# EAGLE schematic board (EAGLE 4.16)
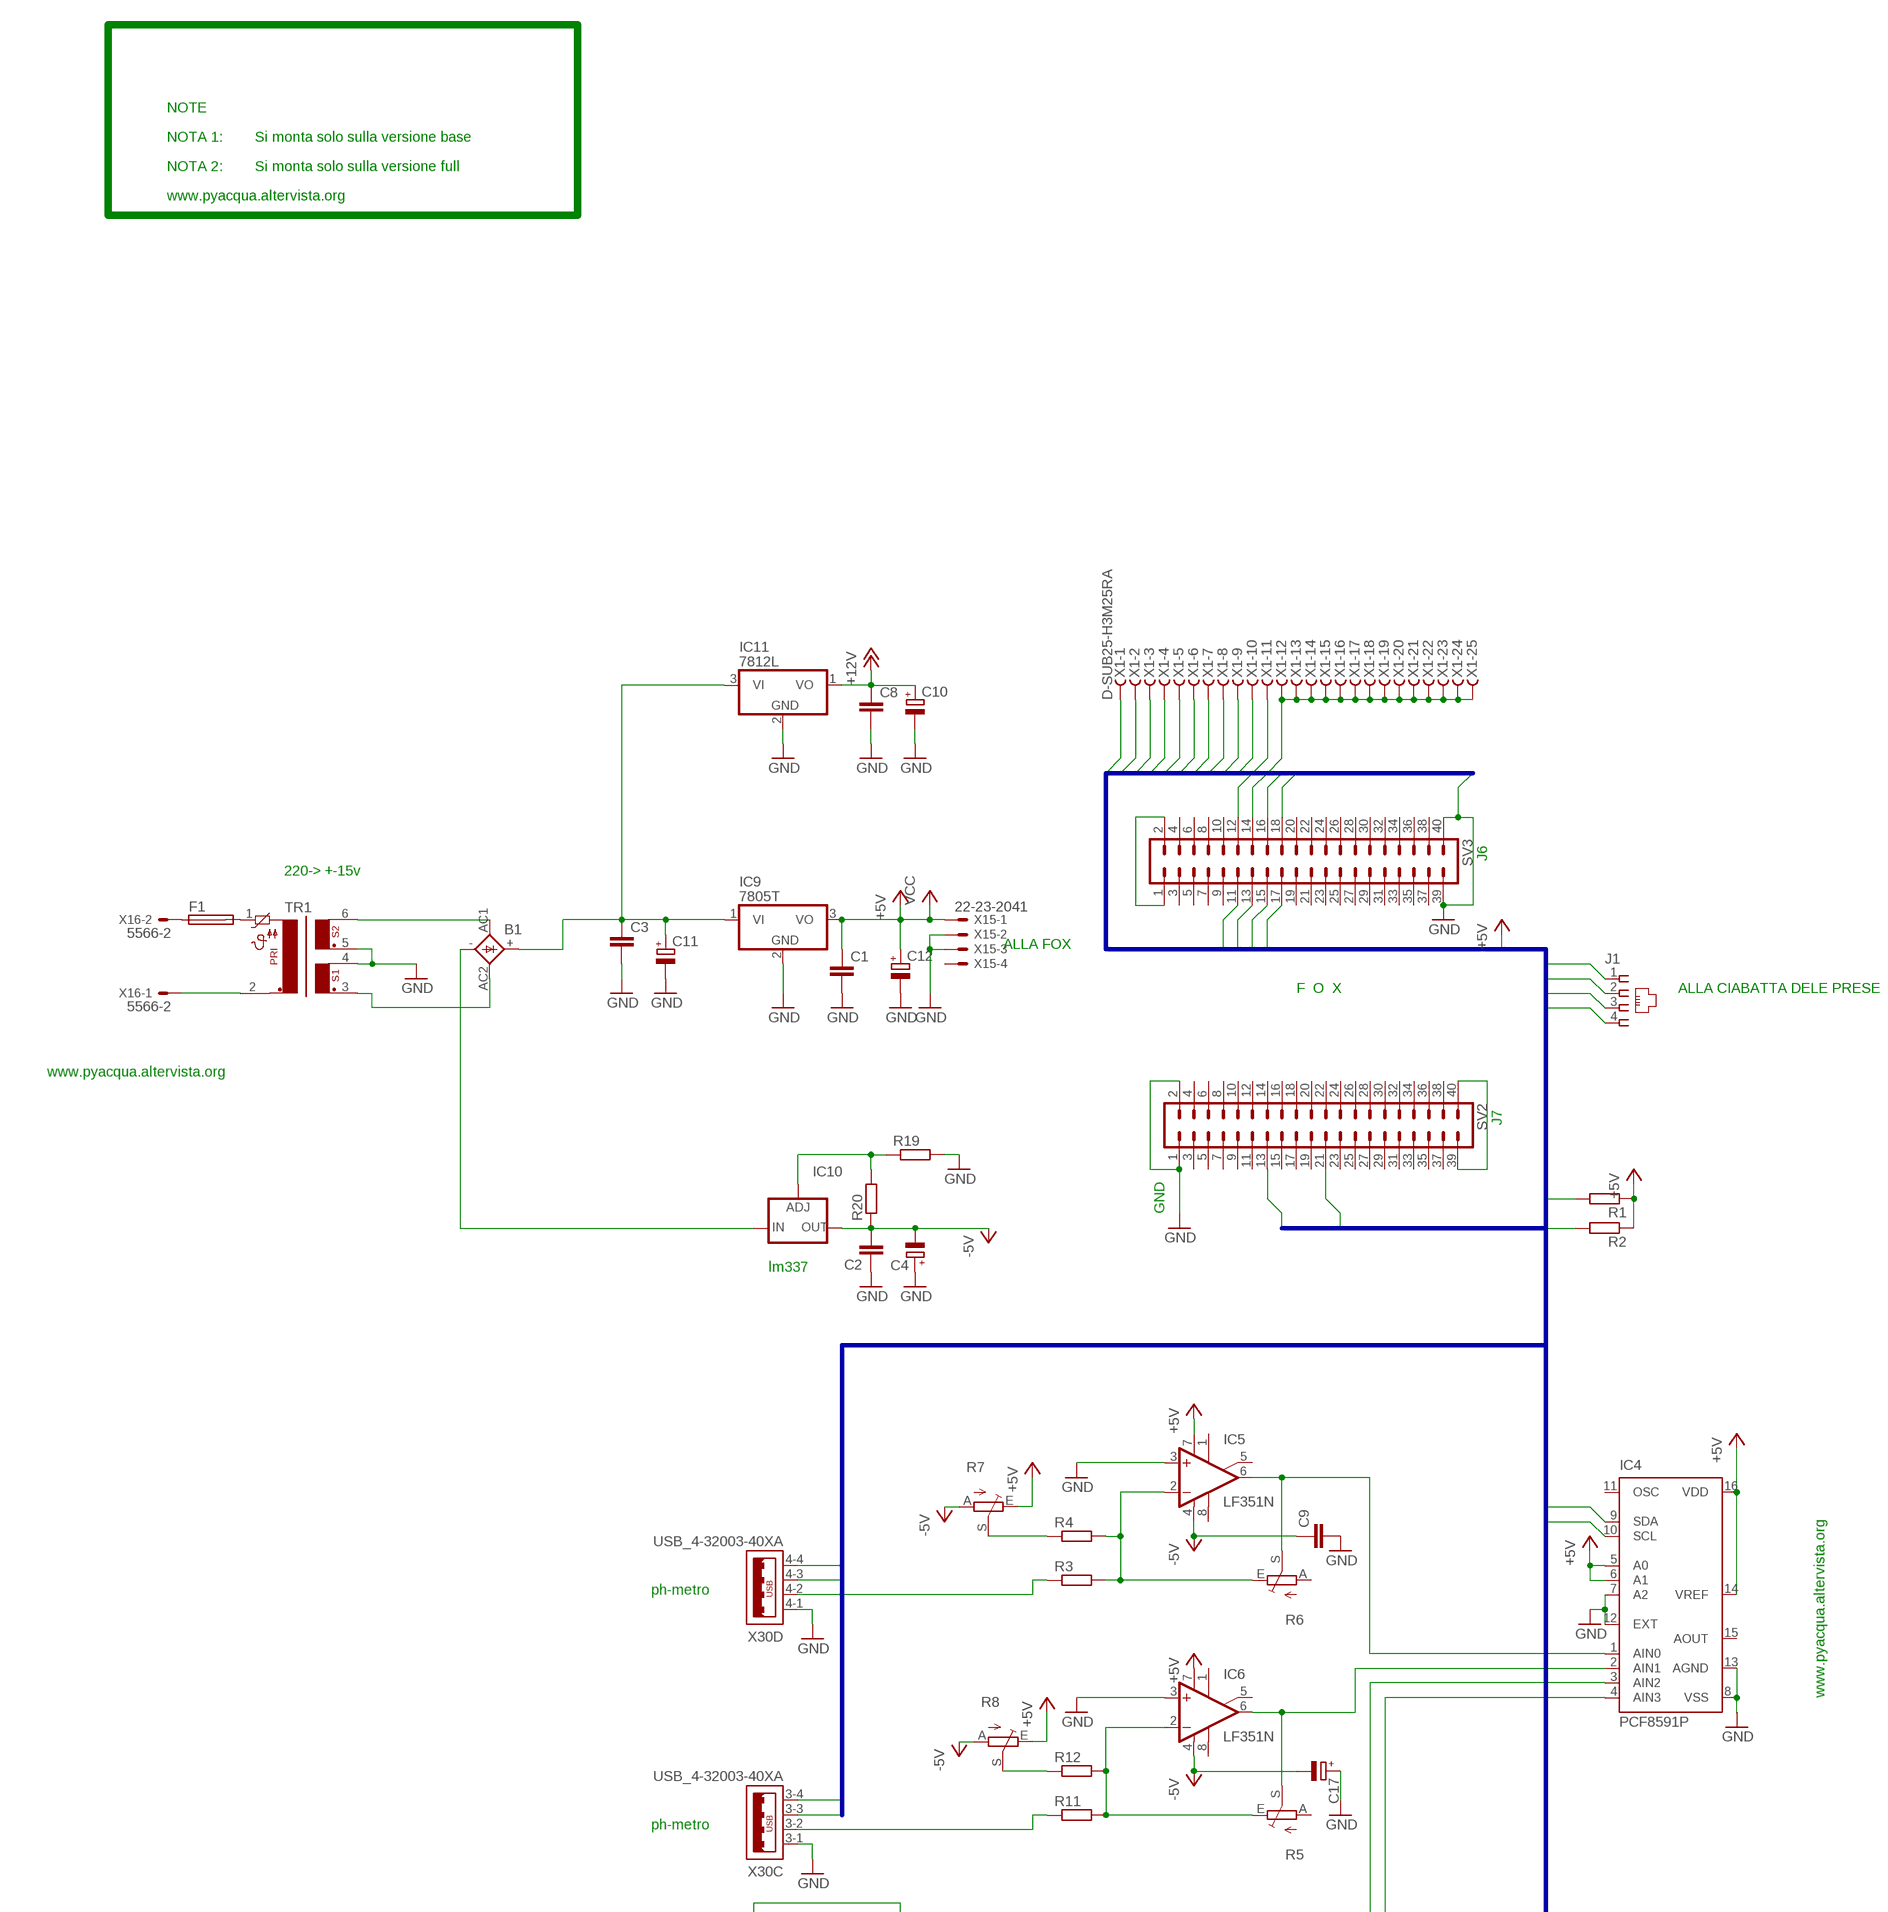
[diagram p0: schematic, sheet 1, part 1 of 3]
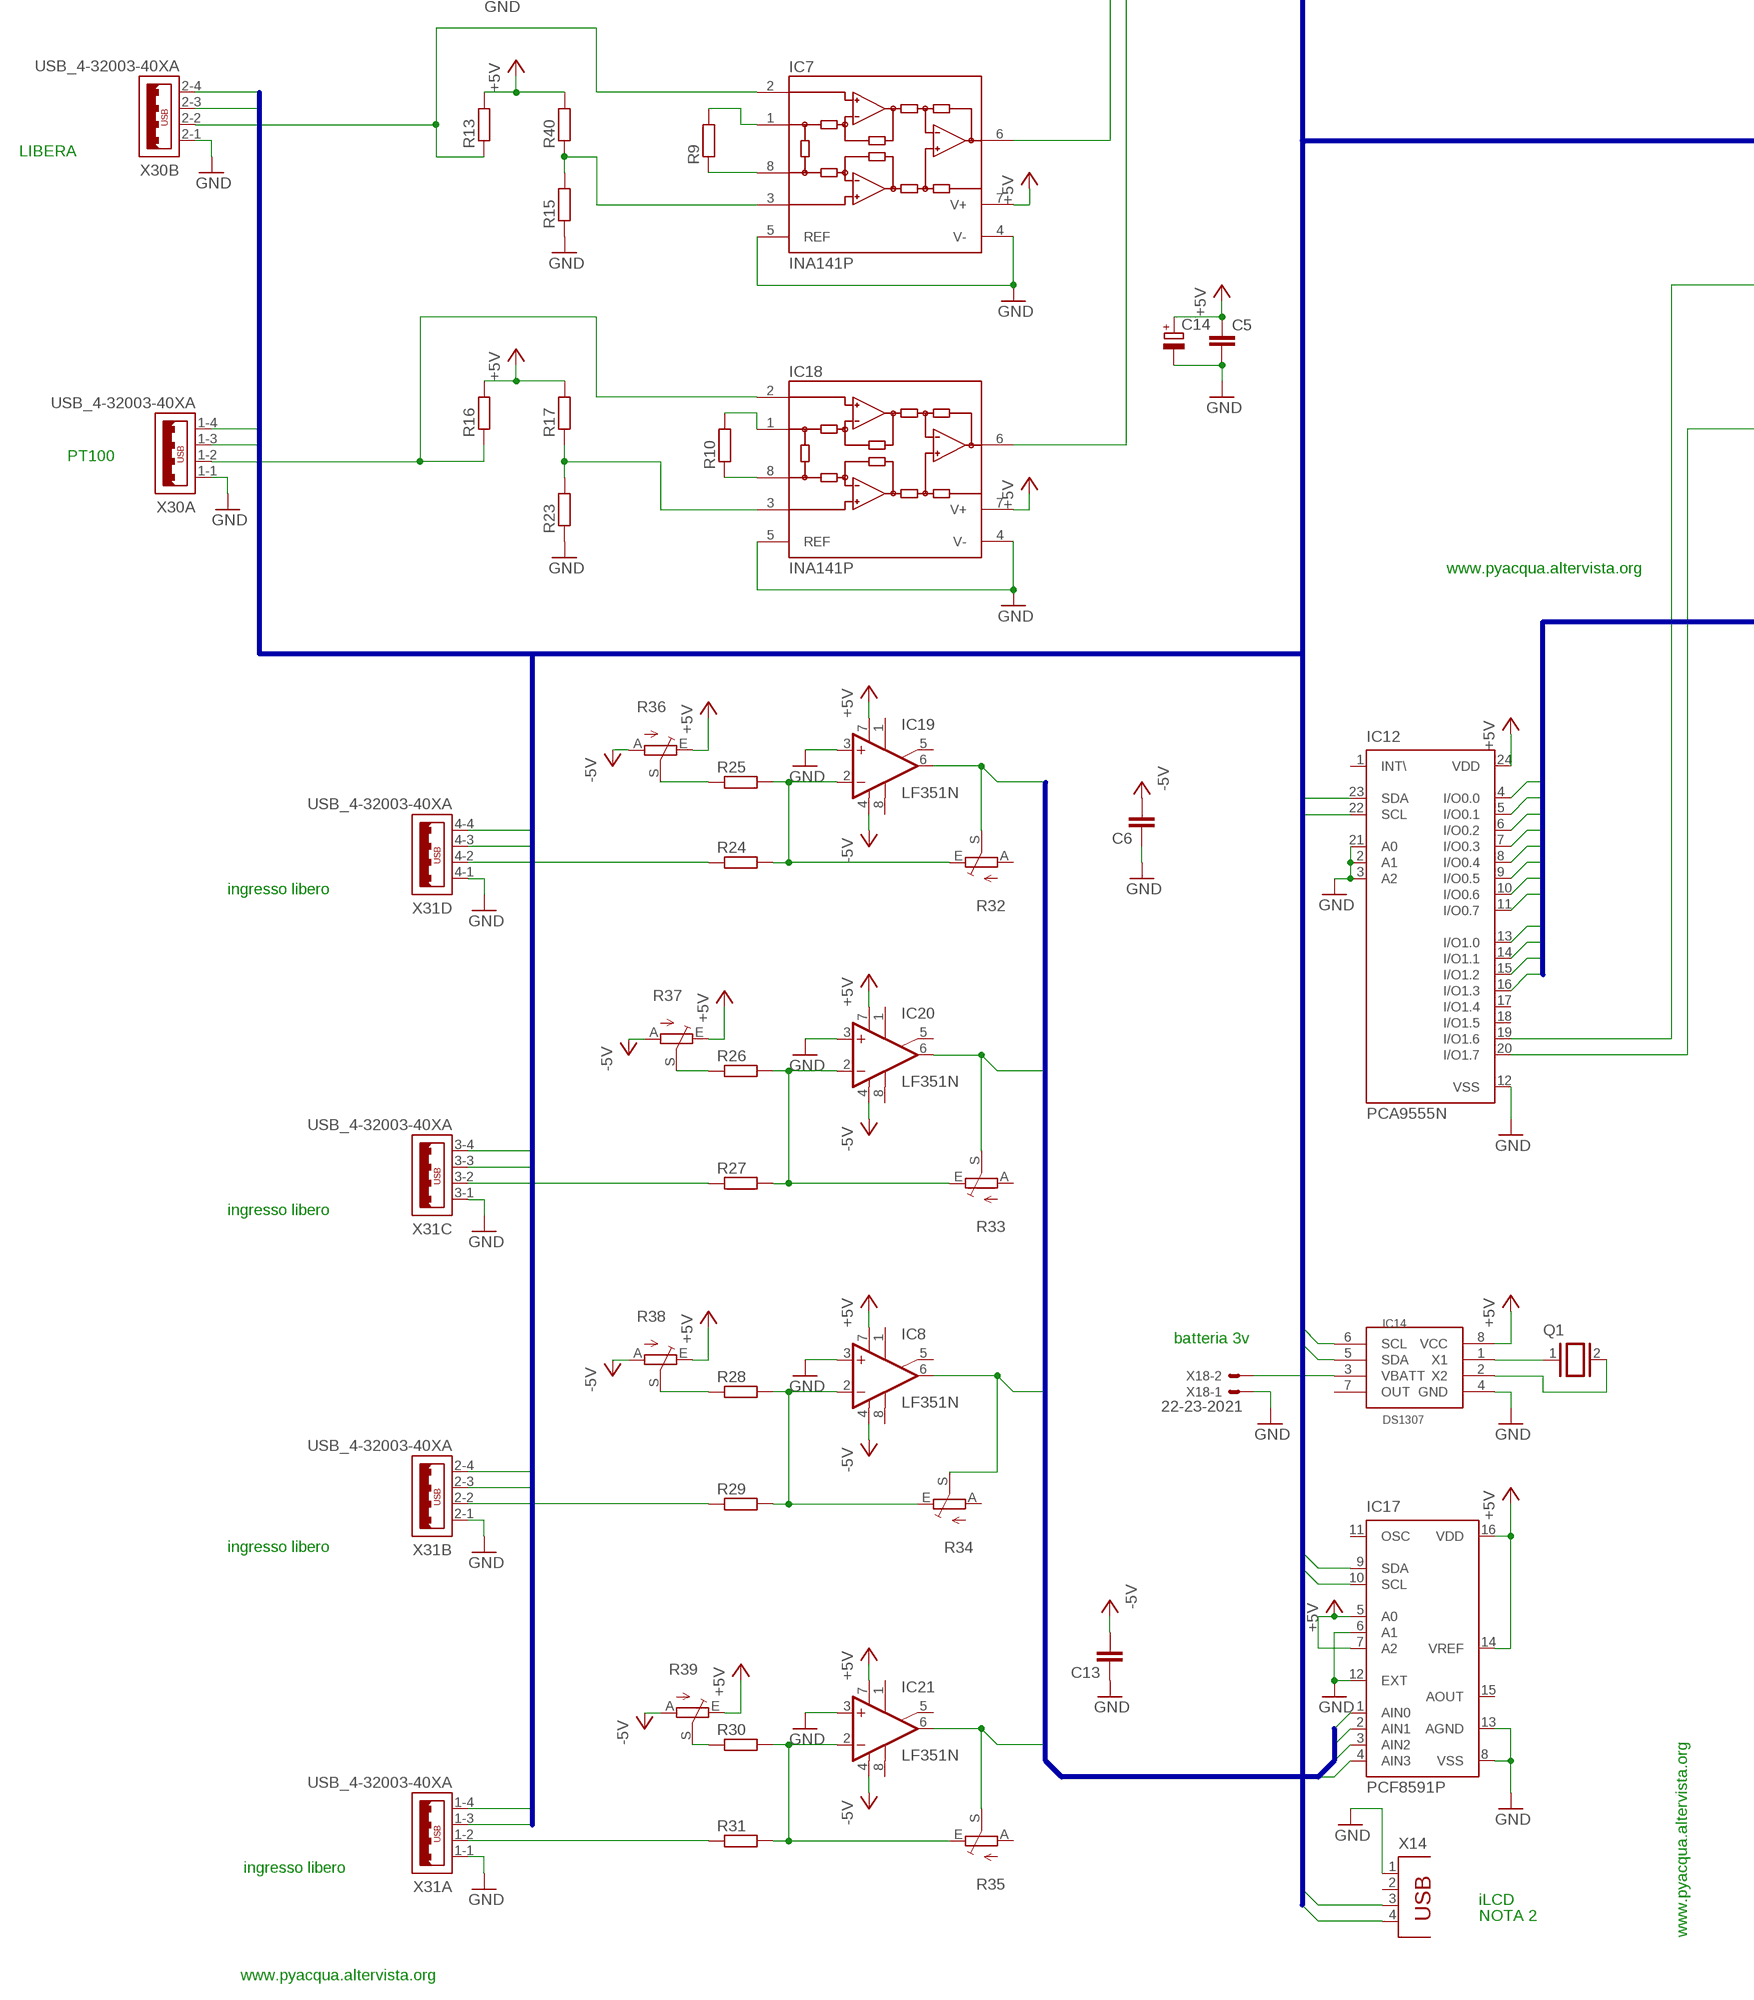
[diagram p1: schematic, sheet 1, part 2 of 3]
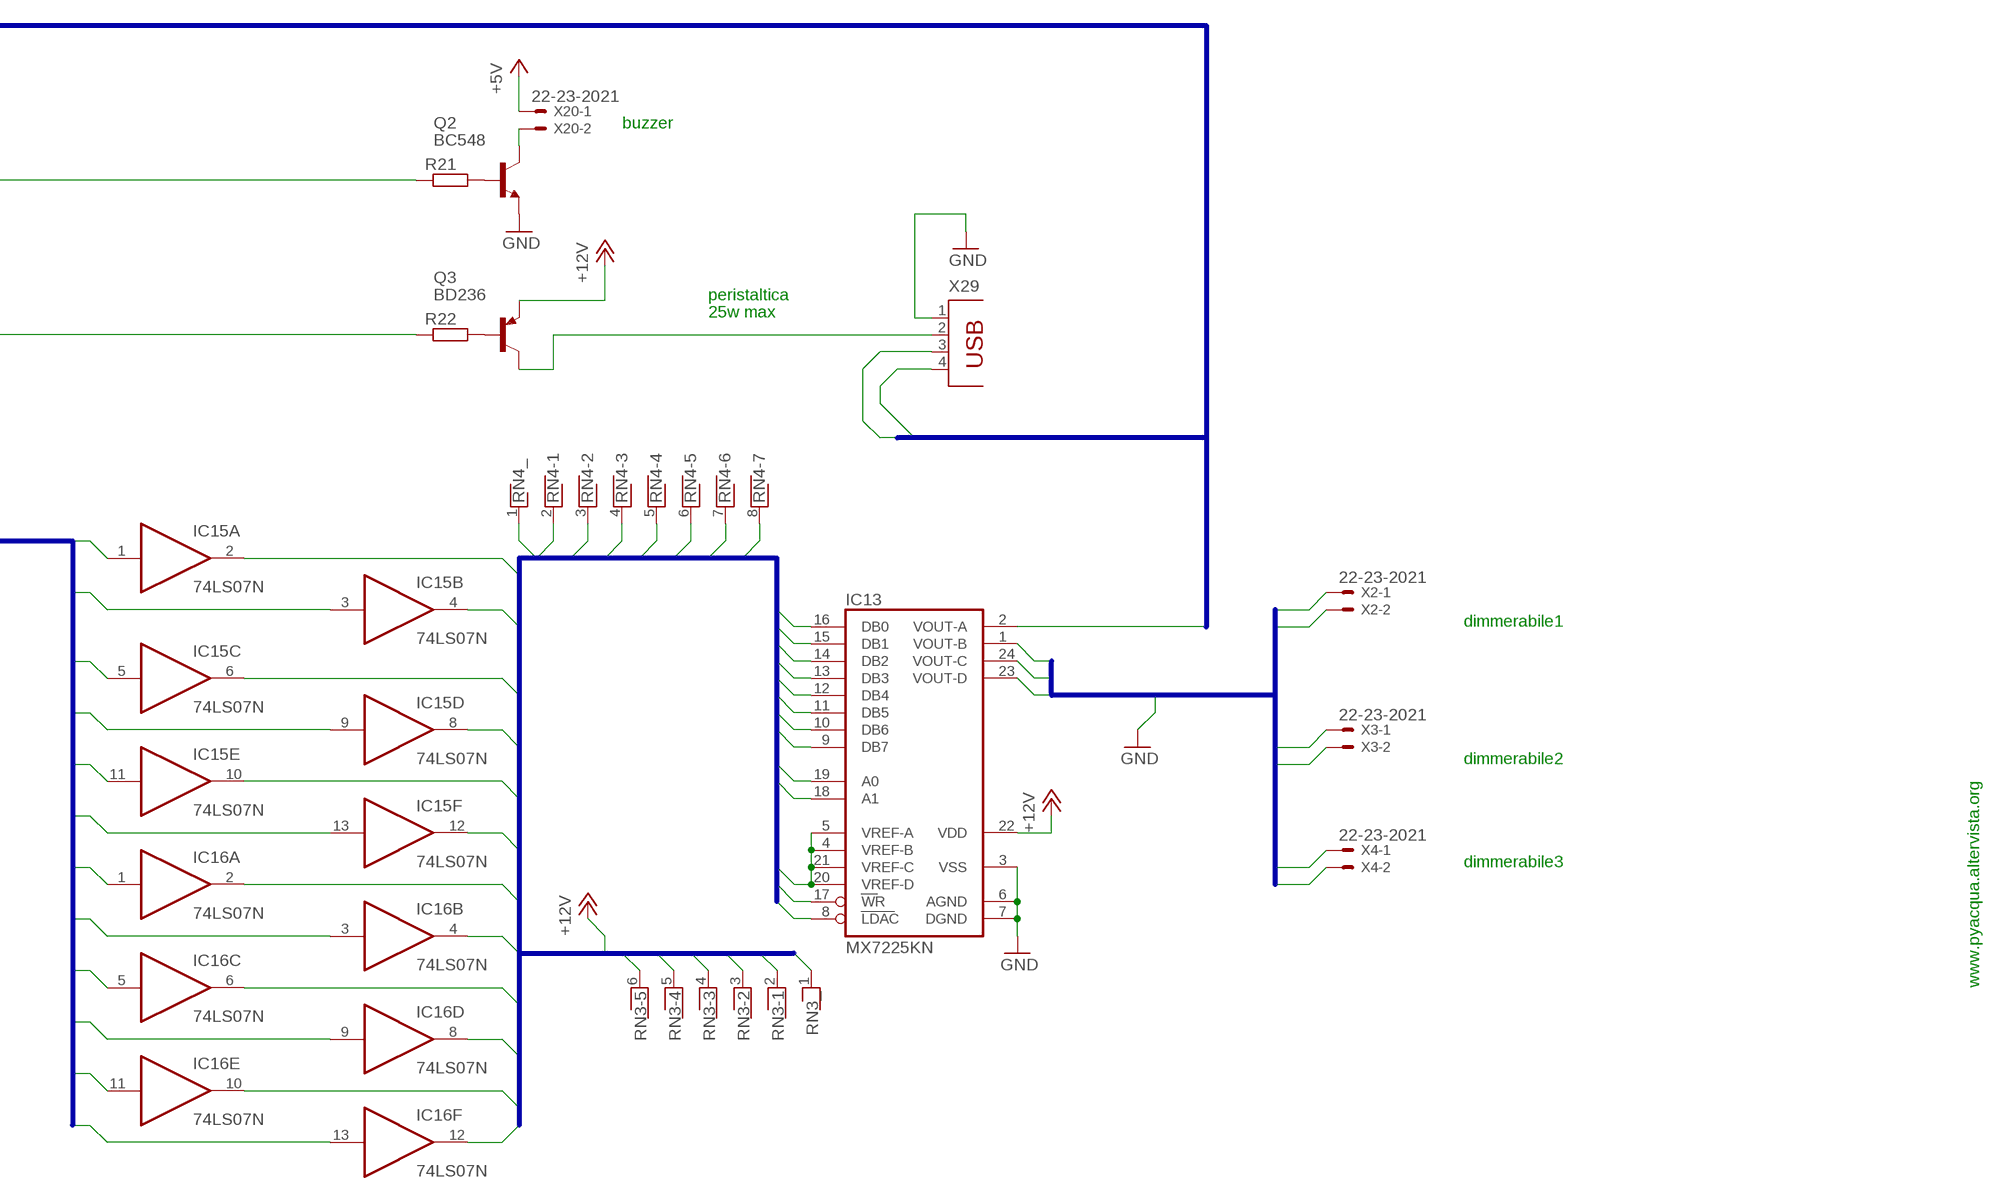
[diagram p2: schematic, sheet 1, part 3 of 3]

## Parts
B1  2KBP  [2KBP]
C1  C-EU025-040X050  [C025-040X050]
C2  C-EU025-040X050  [C025-040X050]
C3  C-EU025-040X050  [C025-040X050]
C4  CPOL-EUE2-5  [E2-5]
C5  C-EU025-040X050  [C025-040X050]
C6  C-EU025-060X050  [C025-060X050]
C8  C-EU025-050X050  [C025-050X050]
C9  C-EU025-040X050  [C025-040X050]
C10  CPOL-EUE2-5  [E2-5]
C11  CPOL-EUE2.5-6  [E2,5-6]
C12  CPOL-EUE2.5-6  [E2,5-6]
C13  C-EU025-060X050  [C025-060X050]
C14  CPOL-EUE2.5-6  [E2,5-6]
C17  CPOL-EUE2.5-6  [E2,5-6]
F1  GSH15  [GSH15]
IC4  PCF8591P  [DIL16]
IC5  LF351N  [DIL08]
IC6  LF351N  [DIL08]
IC7  INA141P  [DIL08]
IC8  LF351N  [DIL08]
IC9  7805T  [TO220H]
IC10  LM337L  [337L]
IC11  7812L  [TO92]
IC12  PCA9555N  [DIL24-6]
IC13  MX7225KN  [DIL24-6]
IC14  DS1307  [DS1307]
IC15  74LS07N  [DIL14]
IC16  74LS07N  [DIL14]
IC17  PCF8591P  [DIL16]
IC18  INA141P  [DIL08]
IC19  LF351N  [DIL08]
IC20  LF351N  [DIL08]
IC21  LF351N  [DIL08]
J1  520242-2  [520242-2]
Q1  XTAL  [Q]
Q2  BC548  [TO92-EBC]
Q3  BD236  [TO126]
R1  R-EU_0207/10  [0207/10]
R2  R-EU_0207/10  [0207/10]
R3  R-EU_0207/10  [0207/10]
R4  R-EU_0207/10  [0207/10]
R5  TRIM_EU-CT6  [CT6]
R6  TRIM_EU-CT6  [CT6]
R7  TRIM_EU-B25P  [B25P]
R8  TRIM_EU-B25P  [B25P]
R9  R-EU_0207/10  [0207/10]
R10  R-EU_0207/10  [0207/10]
R11  R-EU_0207/10  [0207/10]
R12  R-EU_0207/10  [0207/10]
R13  R-EU_0207/10  [0207/10]
R15  R-EU_0207/10  [0207/10]
R16  R-EU_0207/10  [0207/10]
R17  R-EU_0207/10  [0207/10]
R19  R-EU_0207/10  [0207/10]
R20  R-EU_0207/10  [0207/10]
R21  R-EU_0207/10  [0207/10]
R22  R-EU_0207/10  [0207/10]
R23  R-EU_0207/10  [0207/10]
R24  R-EU_0207/10  [0207/10]
R25  R-EU_0207/10  [0207/10]
R26  R-EU_0207/10  [0207/10]
R27  R-EU_0207/10  [0207/10]
R28  R-EU_0207/10  [0207/10]
R29  R-EU_0207/10  [0207/10]
R30  R-EU_0207/10  [0207/10]
R31  R-EU_0207/10  [0207/10]
R32  TRIM_EU-CT6  [CT6]
R33  TRIM_EU-CT6  [CT6]
R34  TRIM_EU-CT6  [CT6]
R35  TRIM_EU-CT6  [CT6]
R36  TRIM_EU-B25P  [B25P]
R37  TRIM_EU-B25P  [B25P]
R38  TRIM_EU-B25P  [B25P]
R39  TRIM_EU-B25P  [B25P]
R40  R-EU_0207/10  [0207/10]
RN3  RNX5  [RN-6]
RN4  RNX7  [RN-8]
SV2  MA20-2  [MA20-2]
SV3  MA20-2  [MA20-2]
TR1  PT07,5-2  [PT07,5-2]
X1  D-SUB25-H3M25RA  [H3M25RA]
X2  22-23-2021  [22-23-2021]
X3  22-23-2021  [22-23-2021]
X4  22-23-2021  [22-23-2021]
X14  PN87520  [PN87520]
X15  22-23-2041  [22-23-2041]
X16  5566-2  [5566-2]
X18  22-23-2021  [22-23-2021]
X20  22-23-2021  [22-23-2021]
X29  PN87520  [PN87520]
X30  USB_4-32003-40XA  [32003-40XA]
X31  USB_4-32003-40XA  [32003-40XA]

## Nets
12V: IC13.4(VREF-B) IC13.5(VREF-A) IC13.20(VREF-D) IC13.21(VREF-C) RN3.1 RN4.1 ; supply symbol labelled +12V
+5V: C1.1 C5.1 C12.+ C14.+ IC4.5(A0) IC4.6(A1) IC4.14(VREF) IC4.16(VDD) IC5.7(V+) IC6.7(V+) IC7.7(V+) IC8.7(V+) IC9.3(VO) IC12.24(VDD) IC14.8(VCC) IC17.5(A0) IC17.7(A2) IC17.14(VREF) IC17.16(VDD) IC18.7(V+) IC19.7(V+) IC20.7(V+) IC21.7(V+) R1.1 R2.1 R7.E R8.E R13.2 R16.2 R17.2 R36.E R37.E R38.E R39.E R40.2 X15.1 X20.1 ; supply symbol labelled VCC
+12V: C8.1 C10.+ IC11.1(VO) IC13.22(VDD)
-5V: C2.2 C4.- C6.2 C9.1 C13.2 C17.- IC5.4(V-) IC6.4(V-) IC8.4(V-) IC10.OUT IC19.4(V-) IC20.4(V-) IC21.4(V-) R7.A R8.A R20.1 R36.A R37.A R38.A R39.A
A0: IC12.13(I/O1.0) IC13.19(A0) IC16.5(C:I) IC16.6(C:O) RN4.2
A1: IC12.14(I/O1.1) IC13.18(A1) IC16.8(D:O) IC16.9(D:I) RN4.3
CH0: IC17.1(AIN0) IC21.6(OUT) R35.S
CH1: IC8.6(OUT) IC17.2(AIN1) R34.S
CH2: IC17.3(AIN2) IC20.6(OUT) R33.S
CH3: IC17.4(AIN3) IC19.6(OUT) R32.S
CONTRASTO: IC13.2(VOUT-A) X1.5
DATA0: IC13.16(DB0) IC15.2(A:O) RN4.5
DATA1: IC13.15(DB1) IC15.4(B:O) RN4.6
DATA2: IC13.14(DB2) IC15.6(C:O) RN4.7
DATA3: IC13.13(DB3) IC15.8(D:O) RN4.8
DATA4: IC13.12(DB4) IC15.10(E:O) RN3.6 SV3.14 X1.8
DATA5: IC13.11(DB5) IC15.12(F:O) RN3.5 SV3.13 X1.9
DATA6: IC13.10(DB6) IC16.2(A:O) RN3.4 SV3.11 SV3.16 X1.10
DATA7: IC13.9(DB7) IC16.4(B:O) RN3.3 SV3.15 X1.11
DB0: IC12.4(I/O0.0) IC15.1(A:I)
DB1: IC12.5(I/O0.1) IC15.3(B:I)
DB2: IC12.6(I/O0.2) IC15.5(C:I)
DB3: IC12.7(I/O0.3) IC15.9(D:I)
DB4: IC12.8(I/O0.4) IC15.11(E:I)
DB5: IC12.9(I/O0.5) IC15.13(F:I)
DB6: IC12.10(I/O0.6) IC16.1(A:I)
DB7: IC12.11(I/O0.7) IC16.3(B:I)
DIM1: IC13.1(VOUT-B) X2.1
DIM2: IC13.24(VOUT-C) X3.1
DIM3: IC13.23(VOUT-D) X4.1
E: SV3.17 X1.6
GND: C1.2 C2.1 C3.2 C4.+ C5.2 C6.1 C8.2 C9.2 C10.- C11.- C12.- C13.1 C14.- C17.+ IC4.7(A2) IC4.8(VSS) IC4.12(EXT) IC4.13(AGND) IC5.3(+IN) IC6.3(+IN) IC7.4(V-) IC7.5(REF) IC8.3(+IN) IC9.2(GND) IC11.2(GND) IC12.2(A1) IC12.3(A2) IC12.12(VSS) IC12.21(A0) IC13.3(VSS) IC13.6(AGND) IC13.7(DGND) IC14.4(GND) IC17.6(A1) IC17.8(VSS) IC17.12(EXT) IC17.13(AGND) IC18.4(V-) IC18.5(REF) IC19.3(+IN) IC20.3(+IN) IC21.3(+IN) J1.1 Q2.E R15.1 R19.2 R23.1 SV2.1 SV2.2 SV3.39 SV3.40 TR1.4 TR1.5 X1.3 X1.12 X1.13 X1.14 X1.15 X1.16 X1.17 X1.18 X1.19 X1.20 X1.21 X1.22 X1.23 X1.24 X1.25 X2.2 X3.2 X4.2 X14.1 X15.2 X15.3 X18.1 X29.1 X30.1-1 X30.2-1 X30.3-1 X30.4-1 X31.1-1 X31.2-1 X31.3-1 X31.4-1
LDAC: IC12.16(I/O1.3) IC13.8(LDAC) IC16.12(F:O) IC16.13(F:I) RN3.2
N$1: IC12.19(I/O1.6) R21.1
N$2: TR1.2 X16.1
N$3: F1.2 TR1.1
N$4: IC7.8(J) R9.1
N$5: IC7.1(J) R9.2
N$6: IC18.8(J) R10.1
N$7: IC18.1(J) R10.2
N$9: IC4.1(AIN0) IC5.6(OUT) R6.S
N$10: IC4.2(AIN1) IC6.6(OUT) R5.S
N$13: IC4.3(AIN2) IC7.6(OUT)
N$22: IC4.4(AIN3) IC18.6(OUT)
N$26: Q2.B R21.2
N$27: Q2.C X20.2
N$31: R8.S R12.1
N$35: B1.AC1 TR1.6
N$40: Q3.3(B) R22.2
N$42: Q3.1(E)
N$51: IC12.20(I/O1.7) R22.1
N$58: IC5.2(-IN) R3.2 R4.2 R6.E
N$60: R3.1 X30.4-2
N$61: Q3.2(C) X29.2
N$62: R4.1 R7.S
N$63: IC6.2(-IN) R5.E R11.2 R12.2
N$66: IC7.3(+IN) R15.2 R40.1
N$67: B1.- IC10.IN
N$68: IC7.2(-IN) R13.1 X30.2-2
N$69: R11.1 X30.3-2
N$70: SV3.1 SV3.2
N$71: SV2.39 SV2.40
N$74: IC14.3(VBATT) X18.2
N$76: B1.+ C3.1 C11.+ IC9.1(VI) IC11.3(VI)
N$77: IC10.ADJ R19.1 R20.2
N$80: B1.AC2 TR1.3
N$83: IC14.1(X1) Q1.1
N$84: IC14.2(X2) Q1.2
N$85: F1.1 X16.2
N$107: IC18.3(+IN) R17.1 R23.2
N$110: IC18.2(-IN) R16.1 X30.1-2
N$113: IC19.2(-IN) R24.2 R25.2 R32.E
N$114: IC20.2(-IN) R26.2 R27.2 R33.E
N$115: IC8.2(-IN) R28.2 R29.2 R34.E
N$116: IC21.2(-IN) R30.2 R31.2 R35.E
N$117: R31.1 X31.1-2
N$119: R29.1 X31.2-2
N$121: R30.1 R39.S
N$122: R28.1 R38.S
N$123: R26.1 R37.S
N$124: R27.1 X31.3-2
N$125: R24.1 X31.4-2
N$126: R25.1 R36.S
RS: SV3.18 X1.7
SCL: IC4.10(SCL) IC12.22(SCL) IC14.6(SCL) IC17.10(SCL) J1.2 R2.2 SV2.13 X1.2 X14.4 X29.4 X30.1-4 X30.2-4 X30.3-4 X30.4-4 X31.1-4 X31.2-4 X31.3-4 X31.4-4
SDA: IC4.9(SDA) IC12.23(SDA) IC14.5(SDA) IC17.9(SDA) J1.3 R1.2 SV2.21 X1.1 X14.3 X29.3 X30.1-3 X30.2-3 X30.3-3 X30.4-3 X31.1-3 X31.2-3 X31.3-3 X31.4-3
VCC: J1.4 SV3.12 X1.4
WR: IC12.15(I/O1.2) IC13.17(WR) IC16.10(E:O) IC16.11(E:I) RN4.4
Unconnected: IC4.11(OSC) IC4.15(AOUT) IC5.1(ON1) IC5.5(ON2) IC5.8(OPT) IC6.1(ON1) IC6.5(ON2) IC6.8(OPT) IC8.1(ON1) IC8.5(ON2) IC8.8(OPT) IC12.1(INT\) IC12.17(I/O1.4) IC12.18(I/O1.5) IC14.7(OUT) IC17.11(OSC) IC17.15(AOUT) IC19.1(ON1) IC19.5(ON2) IC19.8(OPT) IC20.1(ON1) IC20.5(ON2) IC20.8(OPT) IC21.1(ON1) IC21.5(ON2) IC21.8(OPT) R5.A R6.A R32.A R33.A R34.A R35.A SV2.3 SV2.4 SV2.5 SV2.6 SV2.7 SV2.8 SV2.9 SV2.10 SV2.11 SV2.12 SV2.14 SV2.15 SV2.16 SV2.17 SV2.18 SV2.19 SV2.20 SV2.22 SV2.23 SV2.24 SV2.25 SV2.26 SV2.27 SV2.28 SV2.29 SV2.30 SV2.31 SV2.32 SV2.33 SV2.34 SV2.35 SV2.36 SV2.37 SV2.38 SV3.3 SV3.4 SV3.5 SV3.6 SV3.7 SV3.8 SV3.9 SV3.10 SV3.19 SV3.20 SV3.21 SV3.22 SV3.23 SV3.24 SV3.25 SV3.26 SV3.27 SV3.28 SV3.29 SV3.30 SV3.31 SV3.32 SV3.33 SV3.34 SV3.35 SV3.36 SV3.37 SV3.38 X14.2 X15.4

## Buses
BUS:SDA,SCL,GND,VCC,DATA[4..7],CONTRASTO,E,RS
BUS_01:DB[0..7],A[0..1],WR,LDAC
BUS_02:DATA[0..7],A[0..1],WR,LDAC,12V
AN:CH[0..3]
DIMMER:DIM[1..3],GND

## Notes on the sheet
- NOTE
- NOTA 1: | Si monta solo sulla versione base
- NOTA 2: | Si monta solo sulla versione full
- www.pyacqua.altervista.org
- J6
- 220-> +-15v
- ALLA FOX
- F  O  X | ALLA CIABATTA DELE PRESE
- www.pyacqua.altervista.org
- J7
- GND
- lm337
- ph-metro
- www.pyacqua.altervista.org
- ph-metro
- LIBERA
- buzzer
- peristaltica
- 25w max
- PT100
- www.pyacqua.altervista.org
- dimmerabile1
- dimmerabile2
- ingresso libero
- dimmerabile3
- www.pyacqua.altervista.org
- ingresso libero
- batteria 3v
- ingresso libero
- ingresso libero
- iLCD
- NOTA 2
- www.pyacqua.altervista.org
- www.pyacqua.altervista.org

## Power pins joined to a net without a drawn wire
GND: IC15.7(P:GND) IC16.7(P:GND)
VCC: IC15.14(P:VCC) IC16.14(P:VCC)

## Library data of the parts
B1 = rectifier:2KBP: RECTIFIER grid 3 x 3,81 mm
C1-C3 C5 C6 C8 C9 C13 = rcl:C-EU: CAPACITOR, European symbol
C4 C10-C12 C14 C17 = rcl:CPOL-EU: POLARIZED CAPACITOR, European symbol
F1 = fuse:GSH15: FUSE HOLDER grid 15mm, 19649 Wickmann
IC4 IC17 = micro-philips:PCF8591: I2C-Bus D/A CONVERTER
IC5 IC6 IC8 IC19-IC21 = linear:LF351: OP AMP
IC7 IC18 = burr-brown:INA141: Instrumentation Amplifier Precision, Low Power, G = 10, 100
IC9 IC11 = linear:78*: Positive VOLTAGE REGULATOR Source: http://cache.national.com/ds/LM/LM78L05.pdf http://www.fairchildsemi.com/ds/LM/LM7805.pdf
IC10 = v-reg:LM337L: VOLTAGE REGULATOR
IC12 = micro-philips:PCA9555: 16-bit I2C and SMBus I/O port with interrupt Source: PCA9555_5.pdf
IC13 = maxim:MX7225KN: DIGITAL/ANALOG CONVERTER
IC14 = aggiunte:DS1307: DS1307 I2C DEVICE
IC15 IC16 = 74xx-us:74*07: Hex BUFFER, open collector high-voltage output
J1 = con-amp:520242-2: AMP connector
Q1 = special:XTAL: CRYSTAL
Q2 = transistor-npn:BC548*: NPN Transistor
Q3 = transistor-pnp:BD236: PNP Transistor
R1-R4 R9-R13 R15-R17 R19-R31 R40 = rcl:R-EU_: RESISTOR, European symbol
R5-R8 R32-R39 = pot:TRIM_EU-: POTENTIOMETER
RN3 = resistor-net:RNX5: RESISTOR NETWORK
RN4 = resistor-net:RNX7: RESISTOR NETWORK
SV2 SV3 = con-lstb:MA20-2: PIN HEADER
TR1 = trafo:PT07,5-2: TRANSFORMER 1 primary winding, temp. protection fuse, 2 secondary windings, mounting holes BLOCK
X1 = con-thomas-betts:D-SUB25-: D-Subminiatur Connector Source: Electronioc Interconnects European Edition 1998
X2-X4 X18 X20 = con-molex:22-23-2021: .100" (2.54mm) Center Header - 2 Pin
X14 X29 = con-berg:PN87520: BERG USB connector
X15 = con-molex:22-23-2041: .100" (2.54mm) Center Header - 4 Pin
X16 = con-molex:5566-2: Mini FIT connector 2 pol Source: http://www.molex.com
X30 X31 = con-cypressindustries:USB_4-: USB Quad Source: www.cypressindustries.com